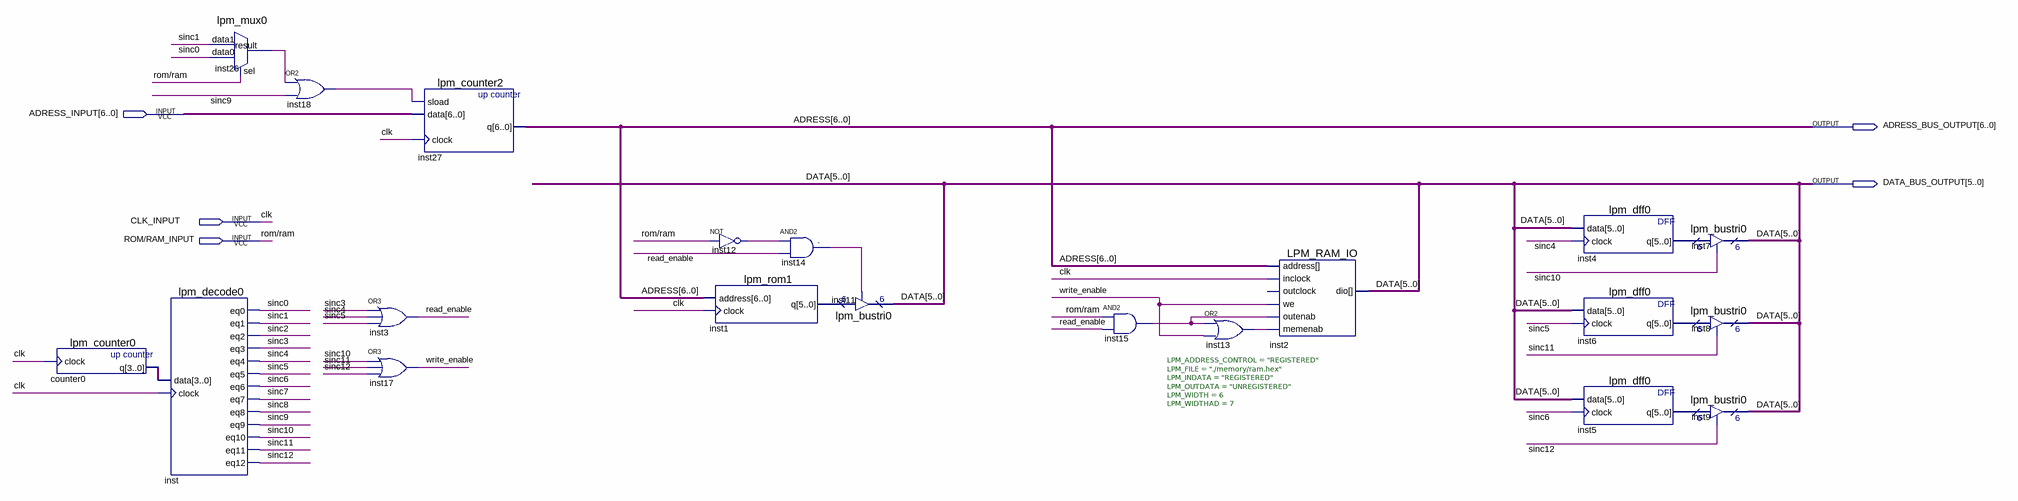
[diagram p0: schematic sheet]
// Quartus schematic LAB3.bdf as structural Verilog: 20 symbols, 5 pins
module LAB3 (
  input  [6:0] ADRESS_INPUT,
  input  CLK_INPUT,
  input  \ROM/RAM_INPUT ,
  output [6:0] ADRESS_BUS_OUTPUT,
  output [5:0] DATA_BUS_OUTPUT
);

  wire inst12_out, inst13_out, inst14_out, inst15_out, inst18_out, inst26_result, read_enable, sinc0, sinc1,
       sinc2, sinc3, sinc4, sinc5, sinc6, sinc7, sinc8, sinc9, sinc10, sinc11, sinc12, write_enable;
  wire [3:0] counter0_q;
  wire [5:0] inst1_q, inst4_q, inst5_q, inst6_q;

  lpm_counter0 counter0 (.clock(CLK_INPUT), .q(counter0_q));
  lpm_decode0 inst (
    .data(counter0_q), .clock(CLK_INPUT), .eq0(sinc0), .eq1(sinc1), .eq2(sinc2), .eq3(sinc3), .eq4(sinc4),
    .eq5(sinc5), .eq6(sinc6), .eq7(sinc7), .eq8(sinc8), .eq9(sinc9), .eq10(sinc10), .eq11(sinc11),
    .eq12(sinc12));
  lpm_mux0 inst26 (.data1(sinc1), .data0(sinc0), .sel(\ROM/RAM_INPUT ), .result(inst26_result));
  or inst18 (inst18_out, inst26_result, sinc9);
  or inst3 (read_enable, sinc3, sinc4, sinc5);
  or inst17 (write_enable, sinc10, sinc11, sinc12);
  lpm_counter2 inst27 (.sload(inst18_out), .data(ADRESS_INPUT), .clock(CLK_INPUT), .q(ADRESS_BUS_OUTPUT));
  not inst12 (inst12_out, \ROM/RAM_INPUT );
  lpm_rom1 inst1 (.address(ADRESS_BUS_OUTPUT), .clock(CLK_INPUT), .q(inst1_q));
  and inst14 (inst14_out, inst12_out, read_enable);
  lpm_bustri0 inst11 (.enabledt(inst14_out), .data(inst1_q), .tridata(DATA_BUS_OUTPUT));
  and inst15 (inst15_out, \ROM/RAM_INPUT , read_enable);
  or inst13 (inst13_out, inst15_out, write_enable);
  LPM_RAM_IO #(.LPM_ADDRESS_CONTROL("REGISTERED"), .LPM_FILE("./memory/ram.hex"), .LPM_INDATA("REGISTERED"), .LPM_OUTDATA("UNREGISTERED"), .LPM_WIDTH(6), .LPM_WIDTHAD(7)) inst2 (
    .address(ADRESS_BUS_OUTPUT), .memenab(inst13_out), .inclock(CLK_INPUT), .we(write_enable),
    .outenab(inst15_out), .dio(DATA_BUS_OUTPUT));  // open: outclock
  lpm_dff0 inst4 (.data(DATA_BUS_OUTPUT), .clock(sinc4), .q(inst4_q));
  lpm_dff0 inst6 (.data(DATA_BUS_OUTPUT), .clock(sinc5), .q(inst6_q));
  lpm_dff0 inst5 (.data(DATA_BUS_OUTPUT), .clock(sinc6), .q(inst5_q));
  lpm_bustri0 inst7 (.enabledt(sinc10), .data(inst4_q), .tridata(DATA_BUS_OUTPUT));
  lpm_bustri0 inst8 (.enabledt(sinc11), .data(inst6_q), .tridata(DATA_BUS_OUTPUT));
  lpm_bustri0 inst9 (.enabledt(sinc12), .data(inst5_q), .tridata(DATA_BUS_OUTPUT));

  // Other names for the same wires on the sheet: ADRESS[6:0] = ADRESS_BUS_OUTPUT; clk = CLK_INPUT;
  //   DATA[5:0] = DATA_BUS_OUTPUT; rom/ram = \ROM/RAM_INPUT 

  // Notes on the sheet:
  //   `
endmodule
